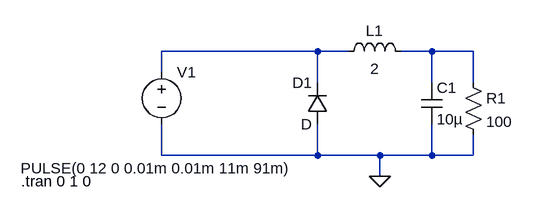
[diagram p0: schematic Buck convert step down.asc]
Buck convert step down.asc, the LTspice schematic file:
Version 4
SHEET 1 880 680
WIRE 208 48 -32 48
WIRE 256 48 208 48
WIRE 384 48 336 48
WIRE 448 48 384 48
WIRE -32 80 -32 48
WIRE 208 96 208 48
WIRE 384 96 384 48
WIRE 448 96 448 48
WIRE -32 208 -32 160
WIRE 208 208 208 160
WIRE 208 208 -32 208
WIRE 304 208 208 208
WIRE 384 208 384 160
WIRE 384 208 304 208
WIRE 448 208 448 176
WIRE 448 208 384 208
WIRE 304 240 304 208
FLAG 304 240 0
SYMBOL voltage -32 64 R0
WINDOW 3 -217 164 Left 2
WINDOW 123 0 0 Left 0
WINDOW 39 0 0 Left 0
SYMATTR Value PULSE(0 12 0 0.01m 0.01m 11m 91m)
SYMATTR InstName V1
SYMBOL cap 368 96 R0
SYMATTR InstName C1
SYMATTR Value 10µ
SYMBOL res 432 80 R0
SYMATTR InstName R1
SYMATTR Value 100
SYMBOL diode 224 160 R180
WINDOW 0 24 64 Left 2
WINDOW 3 24 0 Left 2
SYMATTR InstName D1
SYMBOL ind 240 64 R270
WINDOW 0 32 56 VTop 2
WINDOW 3 5 56 VBottom 2
SYMATTR InstName L1
SYMATTR Value 2
TEXT -248 248 Left 2 !.tran 0 1 0

The netlist it stands for:
* Buck convert step down.asc
V1 N001 0 PULSE(0 12 0 0.01m 0.01m 11m 91m)
C1 N002 0 10µ
R1 N002 0 100
D1 0 N001 D
L1 N001 N002 2
.model D D
.lib standard.dio
.tran 0 1 0
.backanno
.end